# EAGLE design elektrosluch_mini (EAGLE 6.4)
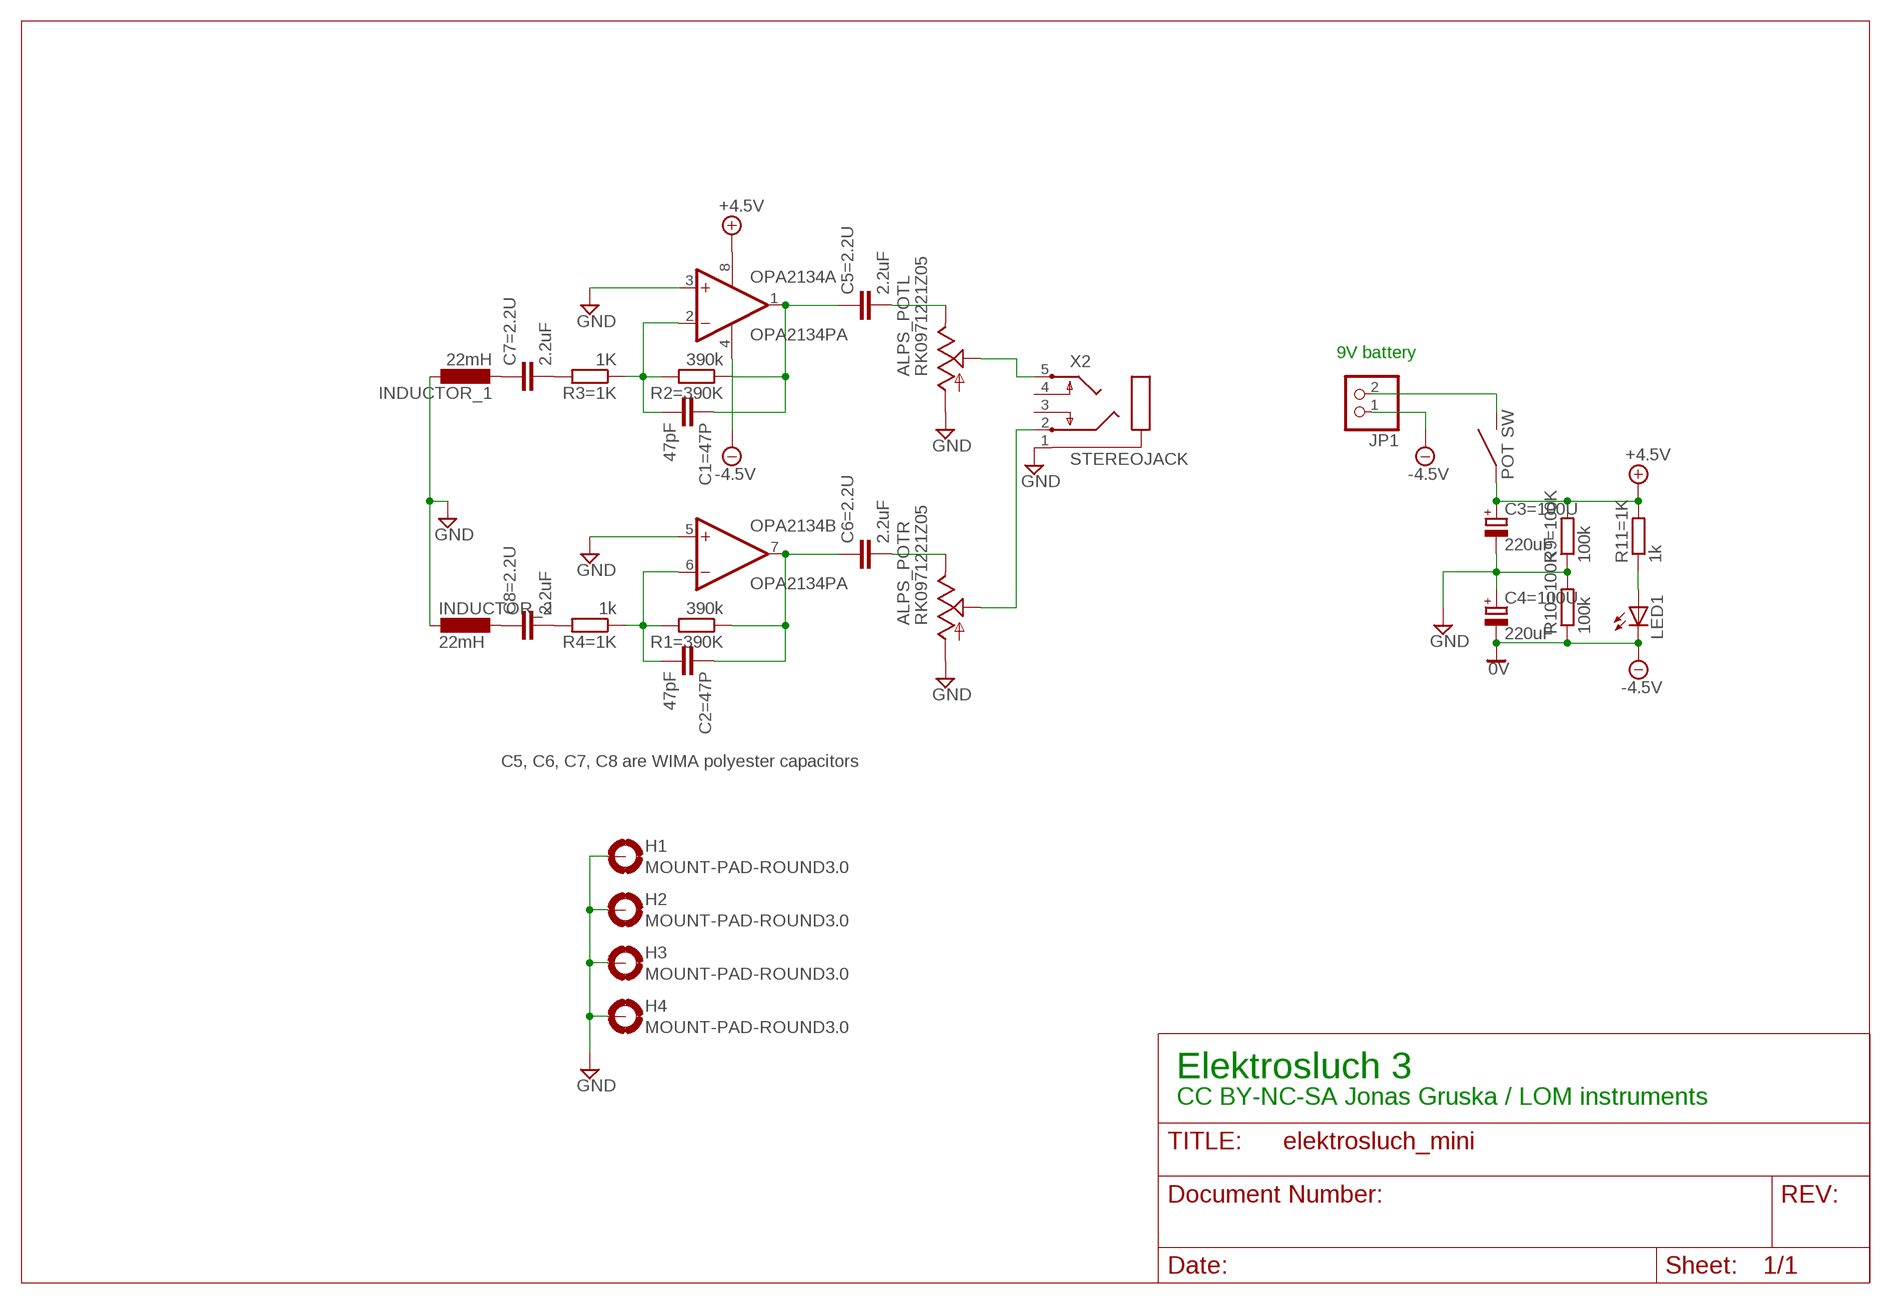
[diagram p0: schematic, sheet 1]

## Parts
ALPS_POT  RK0971221Z05  ALPS_RK0971221Z0N  [ALPS_RK0971221Z0X]
C1=47P  47pF  C-EU050-024X044  [C050-024X044]
C2=47P  47pF  C-EU050-024X044  [C050-024X044]
C3=100U  220uF  CPOL-EUE2.5-5  [E2,5-5]
C4=100U  220uF  CPOL-EUE2.5-5  [E2,5-5]
C5=2.2U  2.2uF  WIMA10UF  [WIMA10UF]
C6=2.2U  2.2uF  WIMA10UF  [WIMA10UF]
C7=2.2U  2.2uF  WIMA10UF  [WIMA10UF]
C8=2.2U  2.2uF  WIMA10UF  [WIMA10UF]
H1  MOUNT-PAD-ROUND3.0  [3,0-PAD]
H2  MOUNT-PAD-ROUND3.0  [3,0-PAD]
H3  MOUNT-PAD-ROUND3.0  [3,0-PAD]
H4  MOUNT-PAD-ROUND3.0  [3,0-PAD]
INDUCTOR_1  22mH  COIL  [COIL]
INDUCTOR_2  22mH  COIL  [COIL]
JP1  PINHD-1X2  [1X02]
LED1  LED3MM  [LED3MM]
OPA2134  OPA2134PA  [DIL08]
R1=390K  390k  R-EU_0207/10  [0207/10]
R2=390K  390k  R-EU_0207/10  [0207/10]
R3=1K  1K  R-EU_0207/10  [0207/10]
R4=1K  1k  R-EU_0207/10  [0207/10]
R9=100K  100k  R-EU_0207/10  [0207/10]
R10=100K  100k  R-EU_0207/10  [0207/10]
R11=1K  1k  R-EU_0207/10  [0207/10]
X2  STEREOJACK  [STX3100]

## Nets
+5V: ALPS_POT.S1 C3=100U.+ OPA2134.8(A:V+) R9=100K.2 R11=1K.2 ; supply symbol labelled +4.5V
-5V: C4=100U.- JP1.1 LED1.K(C) OPA2134.4(A:V-) R10=100K.1 ; supply symbol labelled -4.5V, 0V
GND: ALPS_POT.G1 ALPS_POT.G2 C3=100U.- C4=100U.+ H1.B3,0(MOUNT) H2.B3,0(MOUNT) H3.B3,0(MOUNT) H4.B3,0(MOUNT) INDUCTOR_1.P$1 INDUCTOR_2.P$2 OPA2134.3(A:+IN) OPA2134.5(B:+IN) R9=100K.1 R10=100K.2 X2.1
N$1: C1=47P.2 OPA2134.2(A:-IN) R2=390K.2 R3=1K.1
N$2: C1=47P.1 C5=2.2U.P$1 OPA2134.1(A:OUT) R2=390K.1
N$3: ALPS_POT.I1 C5=2.2U.P$2
N$4: C2=47P.2 OPA2134.6(B:-IN) R1=390K.2 R4=1K.1
N$5: C2=47P.1 C6=2.2U.P$1 OPA2134.7(B:OUT) R1=390K.1
N$6: ALPS_POT.I2 C6=2.2U.P$2
N$7: ALPS_POT.O1 X2.5
N$8: C7=2.2U.P$1 INDUCTOR_1.P$2
N$9: ALPS_POT.O2 X2.2
N$10: C8=2.2U.P$1 INDUCTOR_2.P$1
N$11: C7=2.2U.P$2 R3=1K.2
N$14: LED1.A R11=1K.1
N$15: C8=2.2U.P$2 R4=1K.2
N$16: ALPS_POT.S2 JP1.2
Unconnected: X2.3 X2.4

## Notes on the sheet
- 9V battery
- C5, C6, C7, C8 are WIMA polyester capacitors
- Elektrosluch 3
- CC BY-NC-SA Jonas Gruska / LOM instruments

## Library data of the parts
ALPS_POT = audio-pots:ALPS_RK0971221Z0*: ALPS RK0971221Z Dual-gang 9mm potentiometer for volume control, with SPST switch -05 model: 10K with "volume" taper -0N model: 50K with traditional audio taper
C1=47P C2=47P = rcl:C-EU: CAPACITOR, European symbol
C3=100U C4=100U = rcl:CPOL-EU: POLARIZED CAPACITOR, European symbol
C5=2.2U C6=2.2U C7=2.2U C8=2.2U = mojakniznica:WIMA10UF
H1-H4 = holes:MOUNT-PAD-ROUND: MOUNTING PAD, round
INDUCTOR_1 INDUCTOR_2 = mojakniznica:COIL
JP1 = pinhead:PINHD-1X2: PIN HEADER
LED1 = led:LED: LED OSRAM: - CHIPLED LG R971, LG N971, LY N971, LG Q971, LY Q971, LO R971, LY R971 LH N974, LH R974 LS Q976, LO Q976, LY Q976 LO Q996 - Hyper CHIPLED LW Q18S LB Q993, LB Q99A, LB R99A - SideLED LS A670, LO A670, LY A670, LG A670, LP A670 LB A673, LV A673, LT A673, LW A673 LH A674 LY A675 LS A676, LA A676, LO A676, LY A676, LW A676 LS A679, LY A679, LG A679 - Hyper Micro SIDELED® LS Y876, LA Y876, LO Y876, LY Y876 LT Y87S - SmartLED LW L88C, LW L88S LB L89C, LB L89S, LG L890 LS L89K, LO L89K, LY L89K LS L896, LA L896, LO L896, LY L896 - TOPLED LS T670, LO T670, LY T670, LG T670, LP T670 LSG T670, LSP T670, LSY T670, LOP T670, LYG T670 LG T671, LOG T671, LSG T671 LB T673, LV T673, LT T673, LW T673 LH T674 LS T676, LA T676, LO T676, LY T676, LB T676, LH T676, LSB T676, LW T676 LB T67C, LV T67C, LT T67C, LS T67K, LO T67K, LY T67K, LW E67C LS E67B, LA E67B, LO E67B, LY E67B, LB E67C, LV E67C, LT E67C LW T67C LS T679, LY T679, LG T679 LS T770, LO T770, LY T770, LG T770, LP T770 LB T773, LV T773, LT T773, LW T773 LH T774 LS E675, LA E675, LY E675, LS T675 LS T776, LA T776, LO T776, LY T776, LB T776 LHGB T686 LT T68C, LB T68C - Hyper Mini TOPLED® LB M676 - Mini TOPLED Santana® LG M470 LS M47K, LO M47K, LY M47K Source: http://www.osram.convergy.de LUXEON: - LUMILED® LXK2-PW12-R00, LXK2-PW12-S00, LXK2-PW14-U00, LXK2-PW14-V00 LXK2-PM12-R00, LXK2-PM12-S00, LXK2-PM14-U00 LXK2-PE12-Q00, LXK2-PE12-R00, LXK2-PE12-S00, LXK2-PE14-T00, LXK2-PE14-U00 LXK2-PB12-K00, LXK2-PB12-L00, LXK2-PB12-M00, LXK2-PB14-N00, LXK2-PB14-P00, LXK2-PB14-Q00 LXK2-PR12-L00, LXK2-PR12-M00, LXK2-PR14-Q00, LXK2-PR14-R00 LXK2-PD12-Q00, LXK2-PD12-R00, LXK2-PD12-S00 LXK2-PH12-R00, LXK2-PH12-S00 LXK2-PL12-P00, LXK2-PL12-Q00, LXK2-PL12-R00 Source: www.luxeon.com KINGBRIGHT: KA-3528ASYC Source: www.kingbright.com
OPA2134 = linear:OPA2*: Dual Operational Amplifier Low Power, Single-Supply, Rail-To-Rail Operational Amplifier Source: http://focus.ti.com/lit/ds/symlink/opa2345.pdf http://focus.ti.com .. opa241.pdf http://focus.ti.com/lit/ds/symlink/opa2134.pdf
R1=390K R2=390K R3=1K R4=1K R9=100K R10=100K R11=1K = rcl:R-EU_: RESISTOR, European symbol
X2 = adafruit:STEREOJACK: MIC/HEADPHONE JACK Stereo jack with two switches. Kycon STX3100, CUI SJ1-3555NG and/or 4UCon 05544

## Board
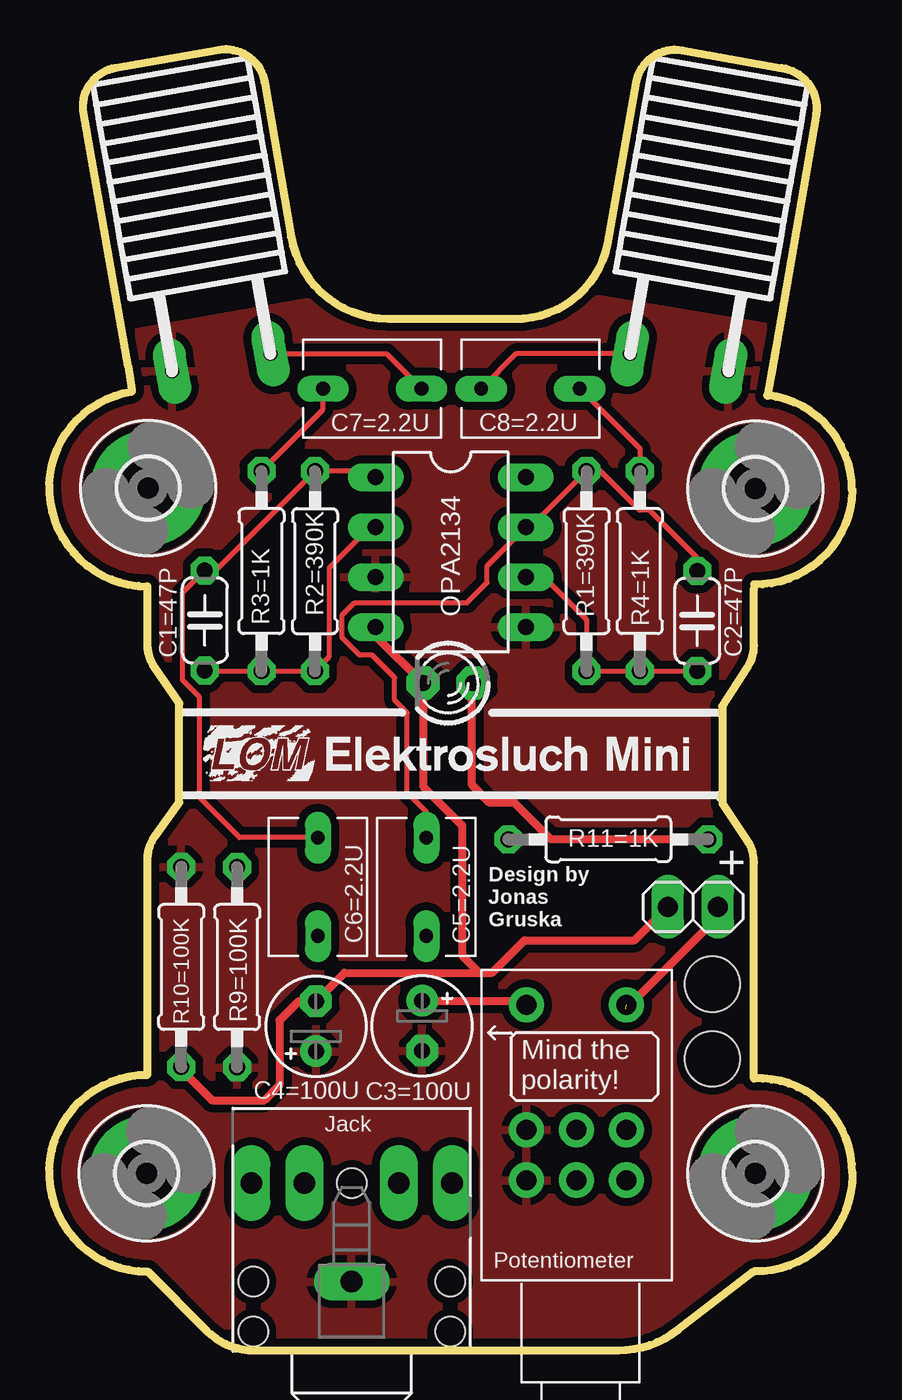
[diagram p1: board, top side]
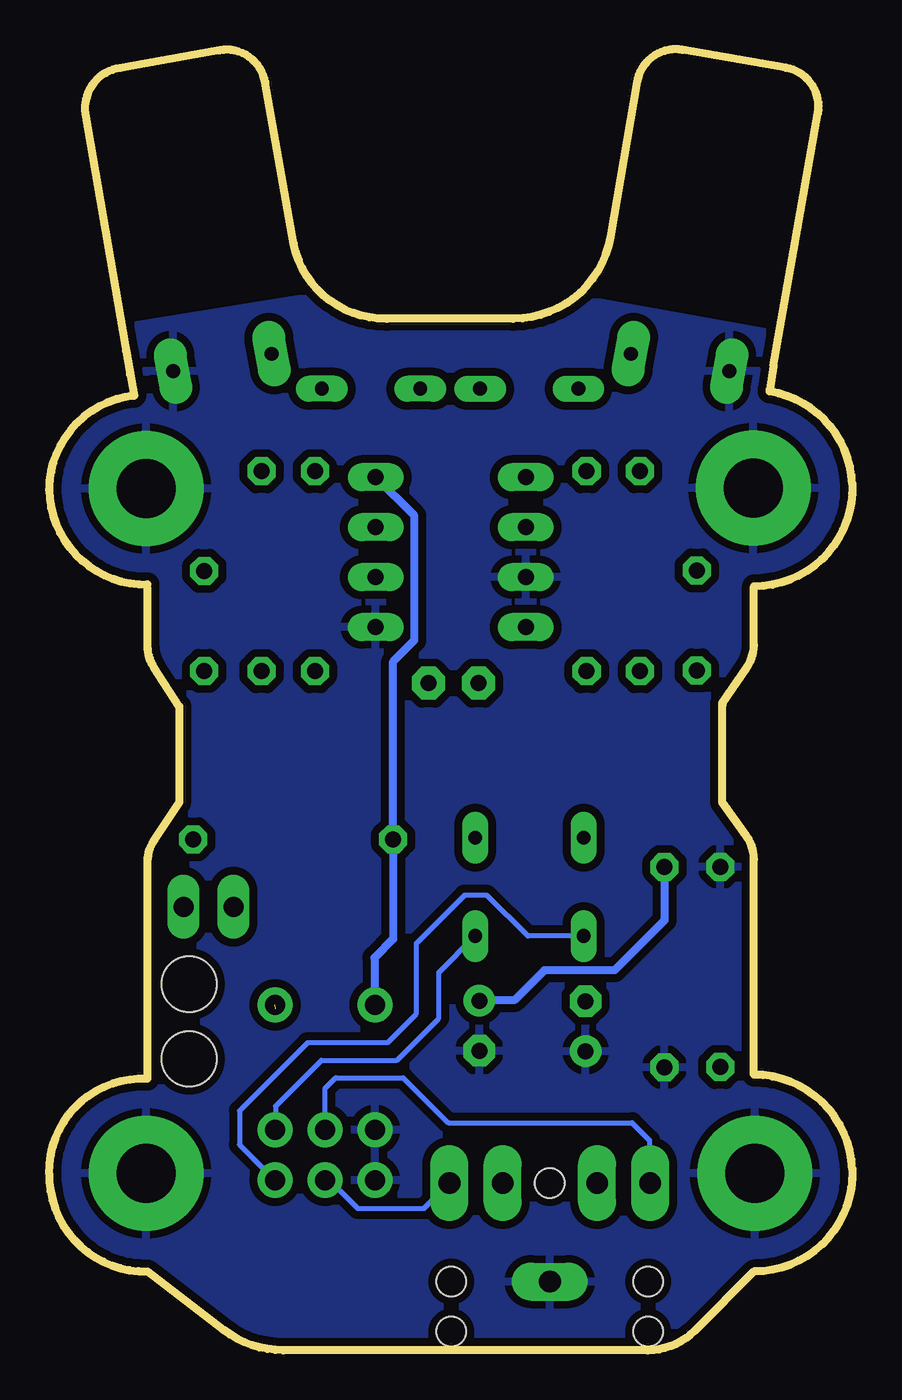
[diagram p2: board, bottom side, seen from below]

Size 40.8 x 66.09 mm. Coordinates in mm from the lower left corner, seen from the top.
Outline: 36.69,49.57 38.97,62.81 arc90 37.21,65.13 32.15,66.03 arc90 29.83,64.41 28.38,56.22 arc-80 23.66,52.4 17.22,52.4 arc-80 12.29,56.55 10.94,64.42 arc90 8.62,66.06 3.37,65.14 arc90 1.75,62.83 4,50 4.2,48.8
Outline: 6.6,27.83 5.38,26.12 arc36 5,24.95 5,14 arc88 0,9.2 arc92 5,4 8.01,0.99 arc45 10.4,0 28.9,0 arc38 31.95,1.04 35.8,4 arc92 40.8,9 arc94 35.8,13.8 35.8,24.8 arc34 35.46,25.9 34.2,27.8
Outline: 6.6,32.87 5.35,34.69 arc-35 5,35.82 5,38.8 arc-92 0,44 arc-78 4.2,48.7
Outline: 34.2,32.7 35.48,34.71 arc33 35.8,35.79 35.8,38.7
Outline: 40.8,43.7 arc-90 35.8,38.9
Outline: 36.89,50.77 36.49,48.47
Outline: 34.2,32.7 34.2,27.8
Outline: 6.6,27.8 6.6,32.8
Outline: 40.79,43.69 arc84 36.47,48.51
Copper layers (1*16): Top 0.0356mm / dielectric 1.5011mm / Bottom 0.0356mm
Design rules "LaenPCBOrder *": minimum track width 6mil, minimum drill 13mil, track to track 6mil, track to pad 6mil, pad to pad 6mil, via to via 6mil, smd to smd 6mil, copper to edge 15mil, drill to drill 6mil, minimum pad ring 12mil, minimum via ring 7mil, stop-mask expansion 3mil, vias tented up to drill 0mil, thermal gap 15mil
Holes 2.8 mm at 33.69,14.8 33.69,18.6

### Footprints (pad centres in the part's own frame; a part is rotated, then mirrored left to right if it is on the bottom)
ALPS_RK0971221Z0X = drill 1.016 pad 1.778: G1 10.74,2.26; G2 8.2,2.26; I1 10.74,7.34; I2 8.2,7.34; O1 10.74,4.8; O2 8.2,4.8; S1 1.85,2.26; S2 1.85,7.34
C050-024X044 = drill 0.813 octagon: 1 -2.54,0; 2 2.54,0
E2,5-5 = drill 0.813 pad 1.6: + -1.27,0 | drill 0.813 pad 1.6 octagon: - 1.27,0
WIMA10UF = drill 0.7 long: P$1 -2.5,0; P$2 2.5,0
3,0-PAD = drill 3 pad 5.842: B3,0 0,0
COIL = drill 0.7 pad 1.676 long: P$1 -2.54,0; P$2 2.54,0
1X02 = drill 1.016 long: 1 -1.27,0; 2 1.27,0
LED3MM = drill 0.813 pad 1.676 octagon: A -1.27,0; K 1.27,0
DIL08 = drill 0.813 pad 1.27 long: 1 -3.81,-3.81; 2 -1.27,-3.81; 3 1.27,-3.81; 4 3.81,-3.81; 5 3.81,3.81; 6 1.27,3.81; 7 -1.27,3.81; 8 -3.81,3.81
0207/10 = drill 0.813 octagon: 1 -5.08,0; 2 5.08,0
STX3100 = drill 1.1 pad 1.93 long: 1 2.7,-0.1; 2 7.7,5; 3 7.7,2.3; 4 7.7,-2.5; 5 7.7,-5.2 | hole 1.5: 2.7,4.9; 2.7,-5.1; 7.7,-0.1; 2.7,4.9; 0.16,4.9; 2.7,-5.1; 0.16,-5.1

### Placement (x,y rotation side)
ALPS_POT  22,19.39 270 top
C1=47P  7.91,37.08 270 top
C2=47P  32.92,37.05 270 top
C3=100U  18.95,16.48 270 top
C4=100U  13.55,16.46 90 top
C5=2.2U  13.65,23.54 270 top
C6=2.2U  19.16,23.54 270 top
C7=2.2U  16.41,48.85 180 top
C8=2.2U  24.45,48.85 0 top
H1  35.87,8.98 0 top
H2  4.94,8.98 0 top
H3  35.87,43.77 0 top
H4  5.02,43.79 0 top
INDUCTOR_1  8.75,50.17 10 top
INDUCTOR_2  32,50.17 350 top
JP1  32.71,22.53 0 top
LED1  20.26,33.88 180 top
OPA2134  20.4,40.54 270 top
R1=390K  27.3,39.58 270 top
R2=390K  13.5,39.58 270 top
R3=1K  10.78,39.58 90 top
R4=1K  30.01,39.58 90 top
R9=100K  9.55,19.46 90 top
R10=100K  6.71,19.47 90 top
R11=1K  28.41,25.95 180 top
U$1  [ELEKTROSLUCHMINI]  7.77,32.26 0 top
X2  15.26,0.79 90 top

### Tracks (layer width: path | path; a pad name or v marks a point on that pad's centre or on a via)
+5V
  Top 0.406: C3=100U.+ 24.04,17.75 ALPS_POT.S1
  Bottom 0.406: R9=100K.2 9.55,21.84 12.08,19.3 15.64,19.3 17.16,17.78 18.92,17.78 C3=100U.+ | OPA2134.8 22.24,42.39 22.24,36.07 23.33,34.98 R11=1K.2 23.33,20.89 24.28,19.94 24.28,17.55 ALPS_POT.S1
-5V
  Top 0.406: R10=100K.1 6.71,14.26 8.27,12.7 10.93,12.7 11.7,13.47 11.7,16.76 12.67,17.73 C4=100U.- 15,19.18 21.86,19.18 | 21.86,19.18 22.5,19.18 24.15,20.83 29.74,20.83 JP1.1 | OPA2134.4 16.59,36.29 LED1.K 18.99,28.65 20.97,26.67 20.97,20.07 21.86,19.18
GND
  pour Top (isolate 0.406): 2.05,51.31 20.72,54.61 40.66,51.31 40.66,2.67 21.74,-4.32 -0.23,2.67 0.15,51.44 2.69,51.44
  pour Bottom (isolate 0.406): -1.38,50.67 20.59,54.61 43.45,50.93 43.45,1.4 22.62,-6.73 -1.38,2.16 -1.63,50.8
N$1
  Top 0.254: OPA2134.2 16.3,41.81 14.24,39.75 14.24,35.24 R2=390K.2 R3=1K.1 7.87,34.5 C1=47P.2
N$2
  Top 0.254: OPA2134.1 16.29,44.66 R2=390K.1 8.46,39.62 C1=47P.1 6.78,38.49 6.78,34.04 7.64,33.17 7.64,28.07 9.67,26.04 C5=2.2U.P$1
N$3
  Bottom 0.254: C5=2.2U.P$2 16.49,21.04 18.56,23.11 19.7,23.11 22.14,20.68 22.14,17.09 23.62,15.62 27.68,15.62 31.13,12.17 31.13,10.44 ALPS_POT.I1
N$4
  Top 0.254: OPA2134.6 24.24,39.24 25.16,39.24 27.3,37.11 R1=390K.2 R4=1K.1 32.91,34.5 C2=47P.2
N$5
  Top 0.254: C6=2.2U.P$1 19.16,27.34 18.18,28.32 18.18,32.38 17.54,33.02 17.54,34.16 16.4,35.31 15.77,35.31 14.88,36.2 14.88,37.34 15.51,37.97 21.23,37.97 22.24,38.99 22.24,39.85 OPA2134.7 24.45,41.81 R1=390K.1 27.34,44.7 27.96,44.7 29.99,42.67 30.48,42.67 32.92,40.23 C2=47P.1
N$6
  Bottom 0.254: ALPS_POT.I2 29.3,11.19 29.3,12.4 26.97,14.73 23.13,14.73 21,16.87 21,19.2 C6=2.2U.P$2
N$7
  Bottom 0.254: ALPS_POT.O1 26.79,8.87 25.13,7.2 21.75,7.2 X2.5
N$8
  Top 0.254: INDUCTOR_1.P$2 17.14,50.62 C7=2.2U.P$1
N$9
  Bottom 0.254: ALPS_POT.O2 26.79,13.29 26.24,13.84 22.82,13.84 20.53,11.56 11.2,11.56 10.31,10.67 10.31,8.53
  Bottom 0.406: 10.31,8.53 X2.2
N$10
  Top 0.254: INDUCTOR_2.P$1 23.72,50.62 C8=2.2U.P$1
N$11
  Top 0.254: R3=1K.2 13.91,47.78 C7=2.2U.P$2
N$14
  Top 0.406: R11=1K.1 25.5,25.95 23.64,27.81 22.37,27.81 21.48,28.7 21.48,33.83 LED1.A
N$15
  Top 0.254: C8=2.2U.P$2 30.01,45.79 R4=1K.2
N$16  (1 unrouted)
  Top 0.406: JP1.2 33.98,22.02 29.3,17.34

### Text on the board
tNames: + | Design by / Jonas / Gruska | Mind the / polarity! | Jack | Potentiometer
tValues: LED | +
bStop: LOM instruments | zvukolom.org | Dedicated to / Janka Kobolkova / & Zorro